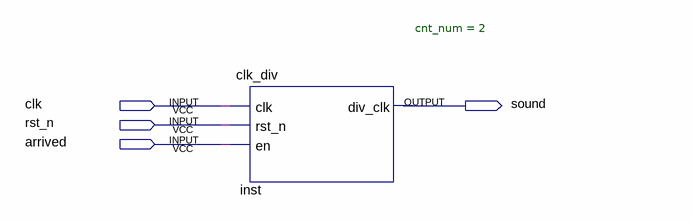
[diagram p0: schematic sheet]
// Quartus schematic sound.bdf as structural Verilog: 1 symbols, 4 pins
module sound (
  input  clk,
  input  rst_n,
  input  arrived,
  output sound
);

  clk_div #(.cnt_num(2)) inst (.clk(clk), .rst_n(rst_n), .en(arrived), .div_clk(sound));
endmodule
